# Altium schematic sheet ZigBee.SchDoc
size A4
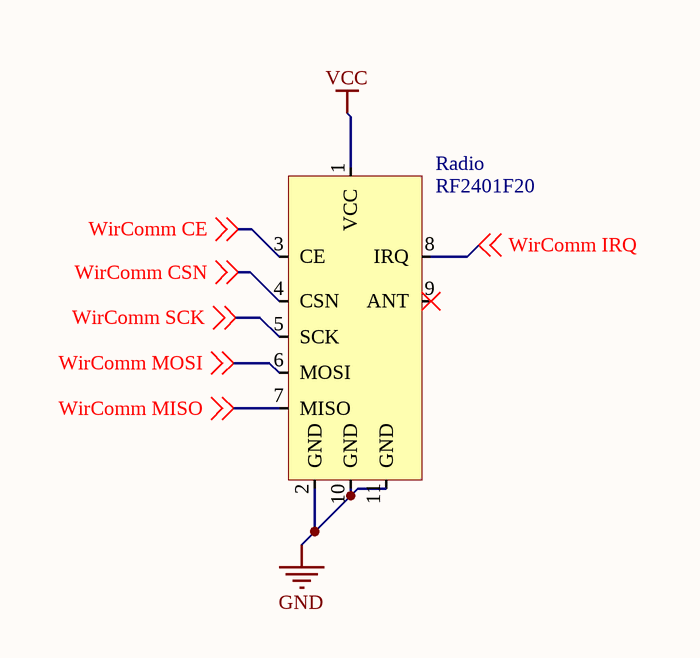
[diagram p0: ZigBee.SchDoc]

## Parts
Radio  RF2401F20  [RF2401F20]

## Nets
GND: Radio.2(GND) Radio.10(GND) Radio.11(GND)
VCC: Radio.1(VCC)
WirComm CE: Radio.3(CE) ; off-sheet WirComm CE
WirComm CSN: Radio.4(CSN) ; off-sheet WirComm CSN
WirComm IRQ: Radio.8(IRQ) ; off-sheet WirComm IRQ
WirComm MISO: Radio.7(MISO) ; off-sheet WirComm MISO
WirComm MOSI: Radio.6(MOSI) ; off-sheet WirComm MOSI
WirComm SCK: Radio.5(SCK) ; off-sheet WirComm SCK

Not connected (* = marked no-connect by the designer): Radio 9(ANT)*